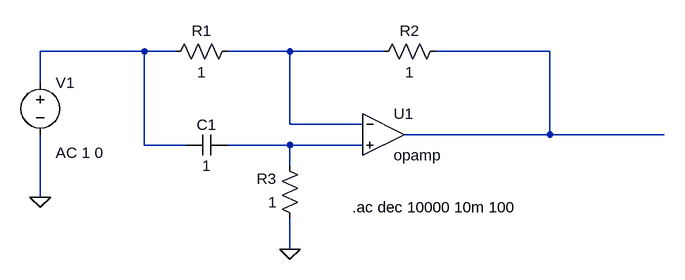
[diagram p0: schematic Semanal#0.asc]
Semanal#0.asc, the LTspice schematic file:
Version 4
SHEET 1 880 680
WIRE -176 32 -336 32
WIRE -128 32 -176 32
WIRE 48 32 -48 32
WIRE 192 32 48 32
WIRE 448 32 272 32
WIRE -336 80 -336 32
WIRE 48 144 48 32
WIRE 160 144 48 144
WIRE 448 160 448 32
WIRE 448 160 224 160
WIRE 624 160 448 160
WIRE -176 176 -176 32
WIRE -112 176 -176 176
WIRE 48 176 -48 176
WIRE 160 176 48 176
WIRE 48 208 48 176
WIRE -336 256 -336 160
WIRE 48 336 48 288
FLAG 48 336 0
FLAG -336 256 0
SYMBOL opamp 192 96 R0
SYMATTR InstName U1
SYMBOL res -32 16 R90
WINDOW 0 0 56 VBottom 2
WINDOW 3 32 56 VTop 2
SYMATTR InstName R1
SYMATTR Value 1
SYMBOL res 288 16 R90
WINDOW 0 0 56 VBottom 2
WINDOW 3 32 56 VTop 2
SYMATTR InstName R2
SYMATTR Value 1
SYMBOL res 64 304 R180
WINDOW 0 36 76 Left 2
WINDOW 3 36 40 Left 2
SYMATTR InstName R3
SYMATTR Value 1
SYMBOL cap -48 160 R90
WINDOW 0 0 32 VBottom 2
WINDOW 3 32 32 VTop 2
SYMATTR InstName C1
SYMATTR Value 1
SYMBOL voltage -336 64 R0
WINDOW 123 24 124 Left 2
WINDOW 39 0 0 Left 0
SYMATTR Value2 AC 1 0
SYMATTR InstName V1
SYMATTR Value ""
TEXT 144 272 Left 2 !.ac dec 10000 10m 100

The netlist it stands for:
* Semanal#0.asc
XU1 N002 N004 N003 opamp Aol=100K GBW=10Meg  ; pins invin noninvin out
R1 N002 N001 1
R2 N003 N002 1
R3 0 N004 1
C1 N004 N001 1
V1 N001 0 AC 1 0
.ac dec 10000 10m 100
.backanno
.end